# Altium schematic sheet MGMEZZ04.SchDoc
size Letter; Author: Adam Gilbert; CompanyName: McGill University; DrawnBy: Adam Gilbert; Organization: Altium Limited; Address1: McGill Cosmology; Address2: 3600 University Street; Address3: Montreal, Quebec; Address4: Canada; DocumentNumber: 1; Revision: Rev2; SheetNumber: 1; SheetTotal: 16; ProjectTitle: DfMux FMC Mezz; ModelNumber: MGMEZZ04; ProjectName: DfMux FMC Mezz
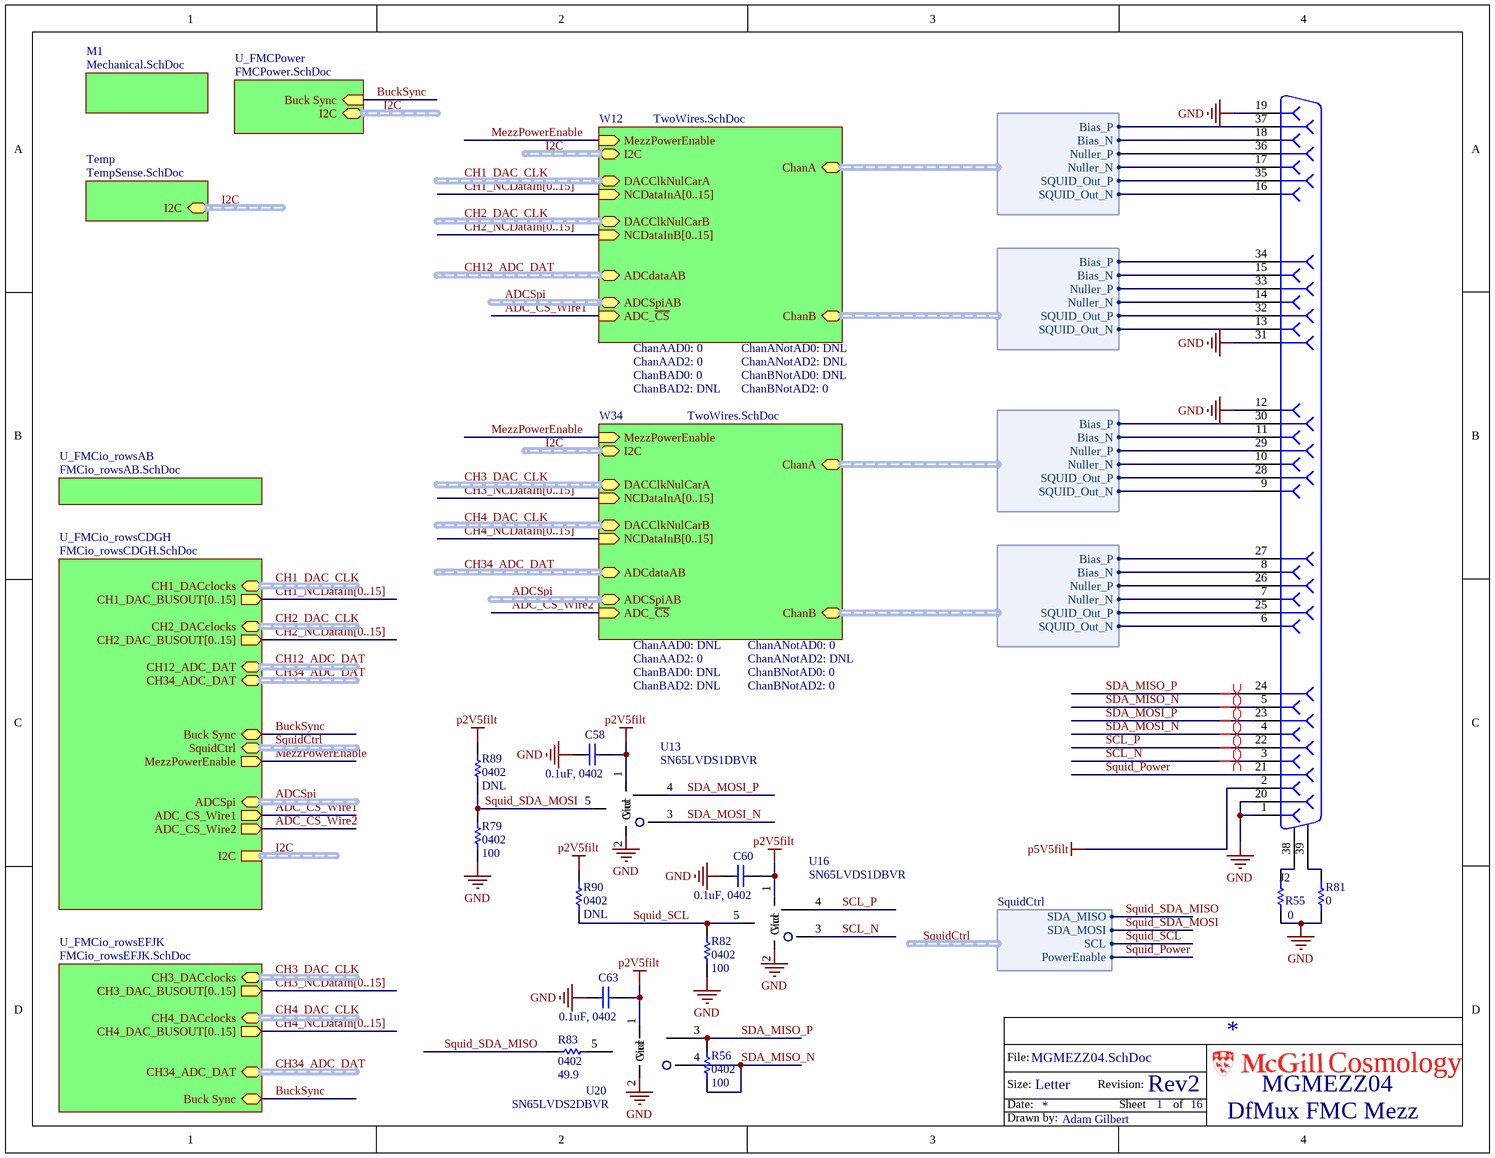
[diagram p0: MGMEZZ04.SchDoc]

## Parts
C58  0.1uF, 0402  [0402]
C60  0.1uF, 0402  [0402]
C63  0.1uF, 0402  [0402]
J2  DB37F_Resize  [DSUB37-F]  (value not drawn)
R55  0  [0603]
R56  100  [0402]
R79  100  [0402]
R81  0  [0603]
R82  100  [0402]
R83  49.9  [0402]
R89  DNL  [0402]
R90  DNL  [0402]
U13  SN65LVDS1DBVR  [SOT23-5]
U16  SN65LVDS1DBVR  [SOT23-5]
U20  SN65LVDS2DBVR  [SOT23-5]

## Sub-sheets
M1 = Mechanical.SchDoc: no entries
Temp = TempSense.SchDoc: I2C (harness I2C)
U_FMCio_rowsAB = FMCio_rowsAB.SchDoc: no entries
U_FMCio_rowsCDGH = FMCio_rowsCDGH.SchDoc: I2C (harness I2C), ADCSpi (harness ADCSPI), ADC_CS_Wire1 (out), ADC_CS_Wire2 (out), CH1_DACclocks (harness DACclks), CH2_DACclocks (harness DACclks), Buck Sync, MezzPowerEnable (out), SquidCtrl (harness SquidCtrl), CH34_ADC_DAT (harness ADCData), CH12_ADC_DAT (harness ADCData), CH1_DAC_BUSOUT[0..15] (out), CH2_DAC_BUSOUT[0..15] (out)
U_FMCio_rowsEFJK = FMCio_rowsEFJK.SchDoc: CH34_ADC_DAT (harness ADCData), CH3_DACclocks (harness DACclks), CH4_DACclocks (harness DACclks), Buck Sync, CH3_DAC_BUSOUT[0..15] (out), CH4_DAC_BUSOUT[0..15] (out)
U_FMCPower = FMCPower.SchDoc: Buck Sync (in), I2C (harness I2C)
W12 = TwoWires.SchDoc: ADCSpiAB (harness ADCSPI), ADCdataAB (harness ADCData), NCDataInA[0..15] (in), NCDataInB[0..15] (in), DACClkNulCarA (harness DACclks), DACClkNulCarB (harness DACclks), ADC_~{CS} (in), ChanA (harness SQUID_CH_OUT), ChanB (harness SQUID_CH_OUT), I2C (harness I2C), MezzPowerEnable (in)  | ChanANotAD0: DNL; ChanANotAD2: DNL; ChanBNotAD0: DNL; ChanBNotAD2: 0; ChanAAD0: 0; ChanAAD2: 0; ChanBAD0: 0; ChanBAD2: DNL
W34 = TwoWires.SchDoc: ADCSpiAB (harness ADCSPI), ADCdataAB (harness ADCData), NCDataInA[0..15] (in), NCDataInB[0..15] (in), DACClkNulCarA (harness DACclks), DACClkNulCarB (harness DACclks), ADC_~{CS} (in), ChanA (harness SQUID_CH_OUT), ChanB (harness SQUID_CH_OUT), I2C (harness I2C), MezzPowerEnable (in)  | ChanANotAD0: 0; ChanANotAD2: DNL; ChanBNotAD0: 0; ChanBNotAD2: 0; ChanAAD0: DNL; ChanAAD2: 0; ChanBAD0: DNL; ChanBAD2: DNL

## Harnesses
SQUID_CH_OUT: Bias_P, Bias_N, Nuller_P, Nuller_N, SQUID_Out_P, SQUID_Out_N
SquidCtrl: SDA_MISO, SDA_MOSI, SCL, PowerEnable

## Nets
GND: C58.2 C60.2 C63.2 J2.1 J2.12 J2.19 J2.20 J2.31 R55.1 R79.1 R81.2 R82.1 U13.2(Gnd) U16.2(Gnd) U20.2(Gnd)
p2V5filt: C58.1 C60.1 C63.1 R89.2 R90.2 U13.1(Vcc) U16.1(Vcc) U20.1(Vcc)
p5V5filt: J2.2
ADC_CS_Wire1: sheet U_FMCio_rowsCDGH/ADC_CS_Wire1, sheet W12/ADC_~{CS}
ADC_CS_Wire2: sheet U_FMCio_rowsCDGH/ADC_CS_Wire2, sheet W34/ADC_~{CS}
BuckSync: sheet U_FMCio_rowsCDGH/Buck Sync, sheet U_FMCio_rowsEFJK/Buck Sync, sheet U_FMCPower/Buck Sync
MezzPowerEnable: sheet U_FMCio_rowsCDGH/MezzPowerEnable, sheet W12/MezzPowerEnable, sheet W34/MezzPowerEnable
SCL_N: J2.3 U16.3(A)
SCL_P: J2.22 U16.4(B)
SDA_MISO_N: J2.5 R56.2 U20.4(B)
SDA_MISO_P: J2.24 R56.1 U20.3(A)
SDA_MOSI_N: J2.4 U13.3(A)
SDA_MOSI_P: J2.23 U13.4(B)
Squid_Power: J2.21 ; sheet U_FMCio_rowsCDGH/SquidCtrl.PowerEnable
Squid_SCL: R82.2 R90.1 U16.5(R) ; sheet U_FMCio_rowsCDGH/SquidCtrl.SCL
Squid_SDA_MISO: R83.2 ; sheet U_FMCio_rowsCDGH/SquidCtrl.SDA_MISO
Squid_SDA_MOSI: R79.2 R89.1 U13.5(R) ; sheet U_FMCio_rowsCDGH/SquidCtrl.SDA_MOSI
NetJ2_6: J2.6 ; sheet W34/ChanB.SQUID_Out_N
NetJ2_7: J2.7 ; sheet W34/ChanB.Nuller_N
NetJ2_8: J2.8 ; sheet W34/ChanB.Bias_N
NetJ2_9: J2.9 ; sheet W34/ChanA.SQUID_Out_N
NetJ2_10: J2.10 ; sheet W34/ChanA.Nuller_N
NetJ2_11: J2.11 ; sheet W34/ChanA.Bias_N
NetJ2_13: J2.13 ; sheet W12/ChanB.SQUID_Out_N
NetJ2_14: J2.14 ; sheet W12/ChanB.Nuller_N
NetJ2_15: J2.15 ; sheet W12/ChanB.Bias_N
NetJ2_16: J2.16 ; sheet W12/ChanA.SQUID_Out_N
NetJ2_17: J2.17 ; sheet W12/ChanA.Nuller_N
NetJ2_18: J2.18 ; sheet W12/ChanA.Bias_N
NetJ2_25: J2.25 ; sheet W34/ChanB.SQUID_Out_P
NetJ2_26: J2.26 ; sheet W34/ChanB.Nuller_P
NetJ2_27: J2.27 ; sheet W34/ChanB.Bias_P
NetJ2_28: J2.28 ; sheet W34/ChanA.SQUID_Out_P
NetJ2_29: J2.29 ; sheet W34/ChanA.Nuller_P
NetJ2_30: J2.30 ; sheet W34/ChanA.Bias_P
NetJ2_32: J2.32 ; sheet W12/ChanB.SQUID_Out_P
NetJ2_33: J2.33 ; sheet W12/ChanB.Nuller_P
NetJ2_34: J2.34 ; sheet W12/ChanB.Bias_P
NetJ2_35: J2.35 ; sheet W12/ChanA.SQUID_Out_P
NetJ2_36: J2.36 ; sheet W12/ChanA.Nuller_P
NetJ2_37: J2.37 ; sheet W12/ChanA.Bias_P
NetJ2_38: J2.38(MH1) R55.2
NetJ2_39: J2.39(MH2) R81.1
NetR83_1: R83.1 U20.5(R)

## Buses and harness runs
bus CH1_NCDataIn[0..15] = sheet U_FMCio_rowsCDGH/CH1_DAC_BUSOUT[0..15]
bus CH1_NCDataIn[0..15] = sheet W12/NCDataInA[0..15]
bus CH2_NCDataIn[0..15] = sheet U_FMCio_rowsCDGH/CH2_DAC_BUSOUT[0..15]
bus CH2_NCDataIn[0..15] = sheet W12/NCDataInB[0..15]
bus CH3_NCDataIn[0..15] = sheet U_FMCio_rowsEFJK/CH3_DAC_BUSOUT[0..15]
bus CH3_NCDataIn[0..15] = sheet W34/NCDataInA[0..15]
bus CH4_NCDataIn[0..15] = sheet U_FMCio_rowsEFJK/CH4_DAC_BUSOUT[0..15]
bus CH4_NCDataIn[0..15] = sheet W34/NCDataInB[0..15]
harness ADCSpi = sheet U_FMCio_rowsCDGH/ADCSpi
harness ADCSpi = sheet W12/ADCSpiAB
harness ADCSpi = sheet W34/ADCSpiAB
harness CH1_DAC_CLK = sheet U_FMCio_rowsCDGH/CH1_DACclocks
harness CH1_DAC_CLK = sheet W12/DACClkNulCarA
harness CH2_DAC_CLK = sheet U_FMCio_rowsCDGH/CH2_DACclocks
harness CH2_DAC_CLK = sheet W12/DACClkNulCarB
harness CH3_DAC_CLK = sheet U_FMCio_rowsEFJK/CH3_DACclocks
harness CH3_DAC_CLK = sheet W34/DACClkNulCarA
harness CH4_DAC_CLK = sheet U_FMCio_rowsEFJK/CH4_DACclocks
harness CH4_DAC_CLK = sheet W34/DACClkNulCarB
harness CH12_ADC_DAT = sheet U_FMCio_rowsCDGH/CH12_ADC_DAT
harness CH12_ADC_DAT = sheet W12/ADCdataAB
harness CH34_ADC_DAT = sheet U_FMCio_rowsCDGH/CH34_ADC_DAT
harness CH34_ADC_DAT = sheet U_FMCio_rowsEFJK/CH34_ADC_DAT
harness CH34_ADC_DAT = sheet W34/ADCdataAB
harness I2C = sheet Temp/I2C
harness I2C = sheet U_FMCio_rowsCDGH/I2C
harness I2C = sheet U_FMCPower/I2C
harness I2C = sheet W12/I2C
harness I2C = sheet W34/I2C
harness SquidCtrl = sheet U_FMCio_rowsCDGH/SquidCtrl

## Layout directives
differential pair: SCL_N, SCL_P, SDA_MISO_N, SDA_MISO_P, SDA_MOSI_N, SDA_MOSI_P

## Notes on the sheet
- File:
- Size:
- Date:
- Letter
- Revision:
- Sheet
- of
- Cosmology
- Drawn by:

## Library data of the parts
C58 C60 C63 = CAP 0603: Capacitor, Ceramic, 0402; Part Constraints: 10% 10V X5R 0402; Manufacturer: TDK Corporation; Manufacturer Part Number 1: C1005X5R1A104K050BA; Temperature Coefficient: X5R; Assembly Comments: none; Value: 0.1uF, 0402; Supplier 1: Digi-Key; Supplier Part Number 1: 445-1265-1-ND; Operating Temperature: -55°C ~ 85°C; Thickness (Max): 0.022" (0.55mm); Packaging: Cut Tape (CT)
J2 = DB37F_Resize: DB37F; Manufacturer: Norcomp Inc.; Part Constraints: 182-037-213R181; Assembly Comments: none; Manufacturer Part Number 1: 182-037-213R181; Supplier 1: Digi-Key; Supplier Part Number 1: 182-837FE-ND
R55 R81 = RES 0603: Manufacturer: e.g CRCW0603 series; Part constraints: 0 1/10W 1% 100ppm/C 0603; Assembly Comments: none; Manufacturer Part Number 1: e.g CRCW0603 series; Value: 0; Supplier 1: Digi-Key; Supplier Part Number 1: 541-0.0GCT-ND
R56 R79 R82 R83 R89 R90 = RES 0402: Resistor; Manufacturer: Generic; Part Constraints: 1% 1/10W 100ppm 0402; Assembly Comments: none; Manufacturer Part Number 1: Generic
  R56 R79 R82: Value: 100
  R83: Value: 49.9
  R89 R90: Value: DNL
U13 U16 = SN65LVDS1DBVR: IC HIGH DIFF LINE DRIVER SOT23-5; Manufacturer: Texas Instruments; Assembly Comments: none; Supplier 1: Digi-Key; Manufacturer Part Number 1: SN65LVDS1DBVR; Packaging: Cut Tape (CT); Supplier Part Number 1: 296-6919-1-ND; Part Constraints: SN65LVDS1DBVR
U20 = SN65LVDS2DBVR: IC DIF LINE DRVR/RCVR HS SOT23-5; Manufacturer: Texas Instruments; Assembly Comments: none; Supplier 1: Digi-Key; Manufacturer Part Number 1: SN65LVDS2DBVR; Packaging: Cut Tape (CT); Supplier Part Number 1: 296-6920-1-ND; Part Constraints: SN65LVDS2DBVR